# EasyEDA Pro project ProProject_stm32_motordrive_2024-05-07.epro

# Schematic Schematic
Create Date: 2024-04-02; Page Name: P1; Project Name: stm32-motordrive; Schematic Name: Schematic; Update Date: 2024-04-13; Company: 嘉立创EDA; Page Size: A4; Version: V1.0
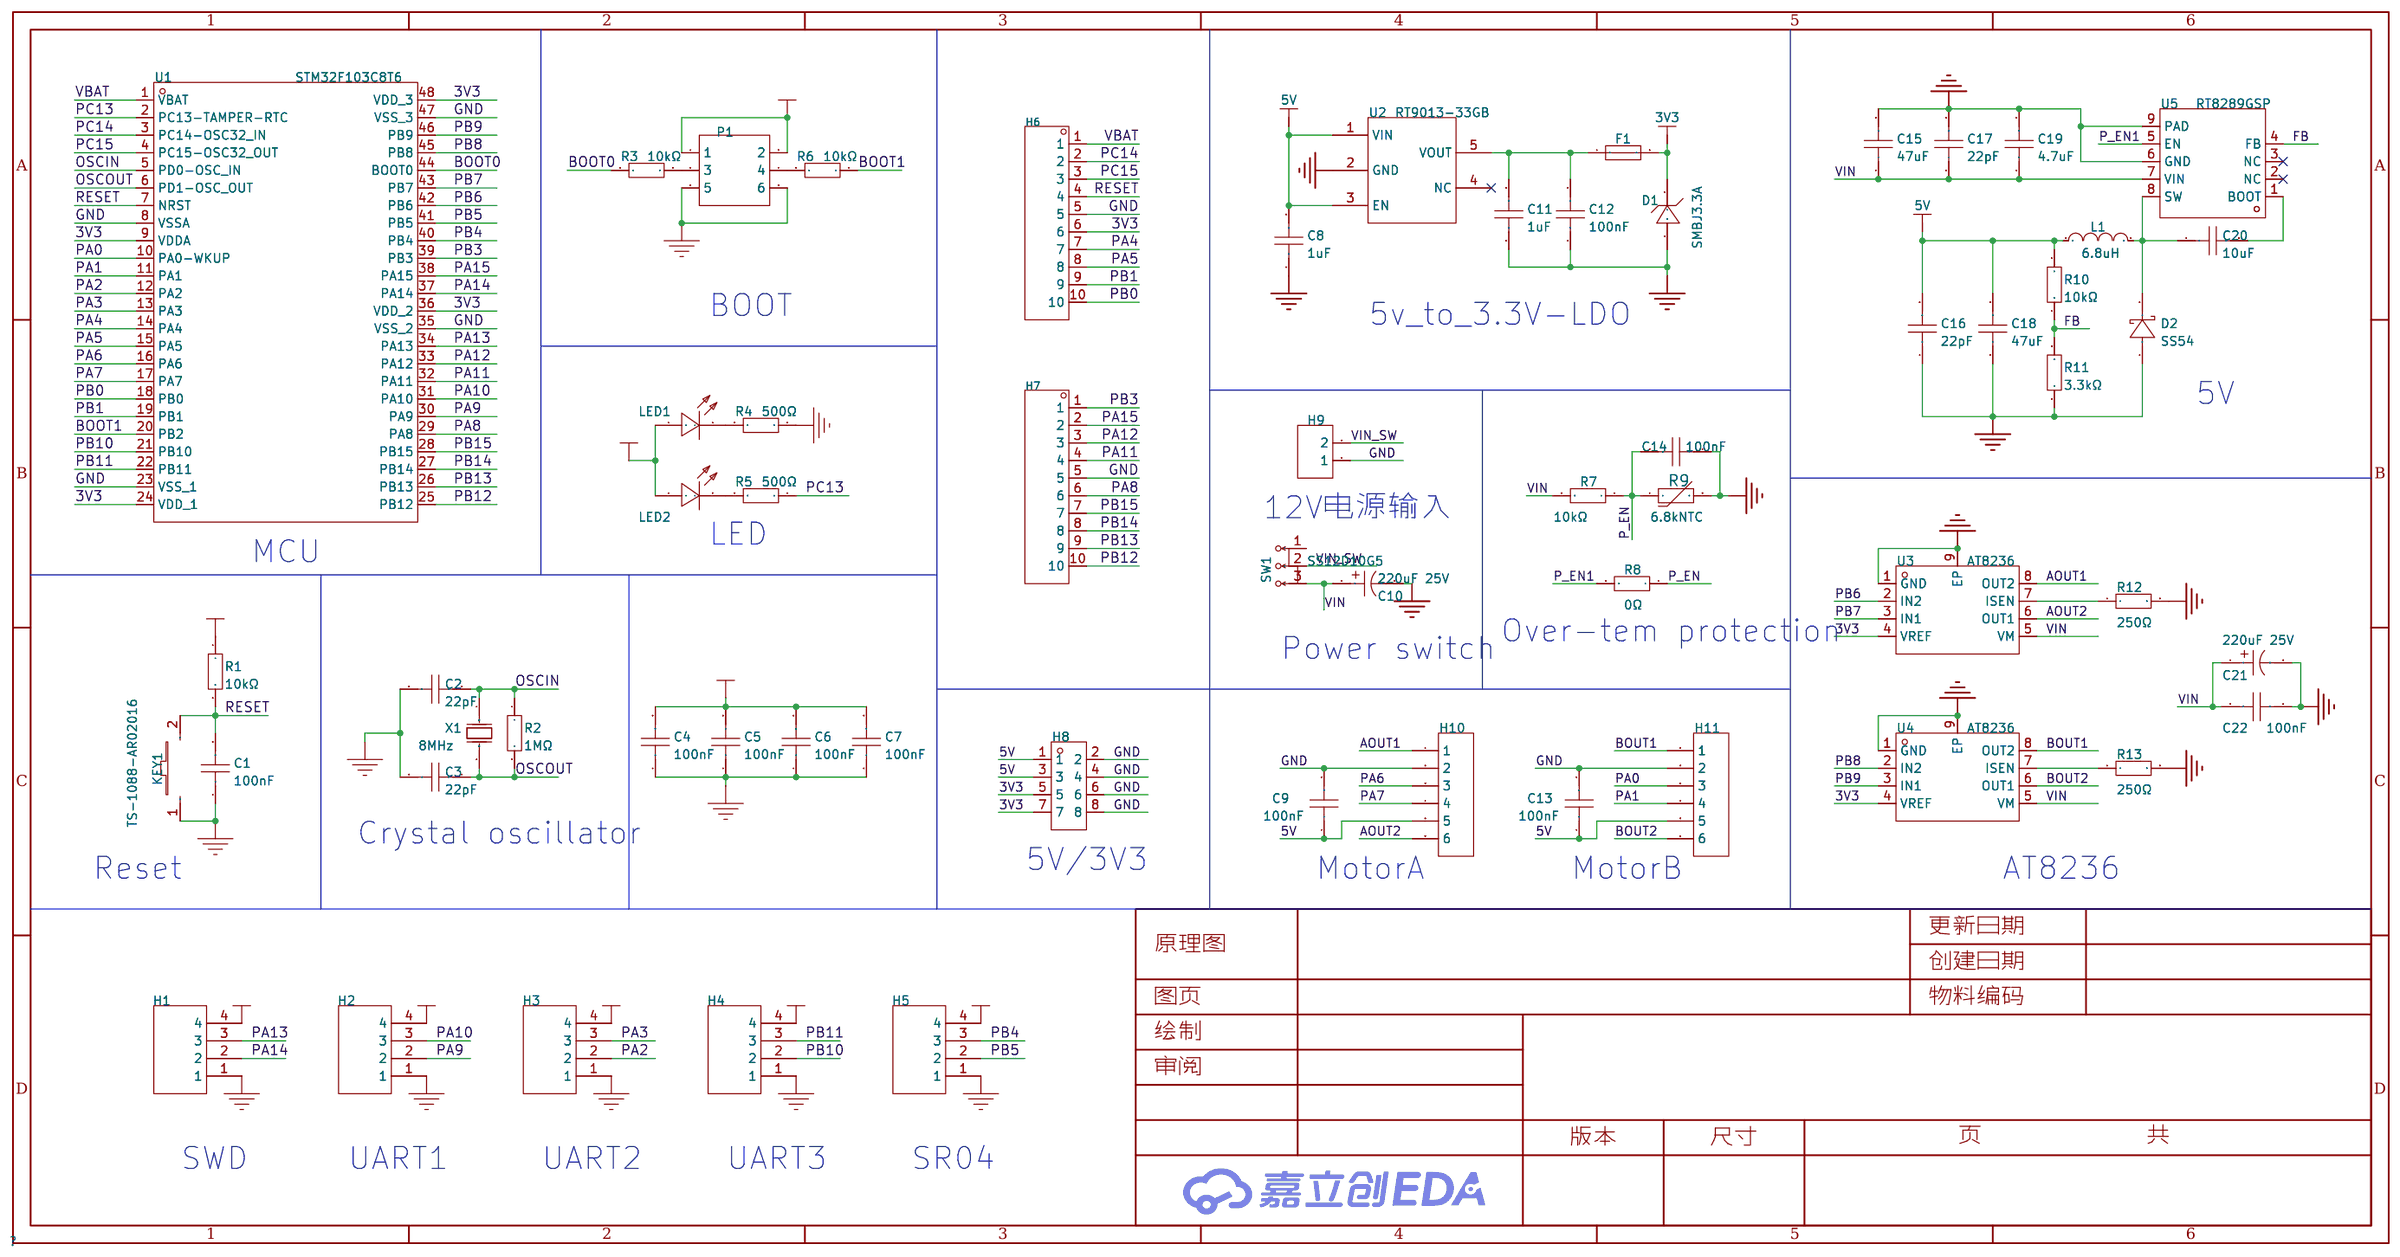
[diagram p0: schematic sheet]

## Parts
C1  100nF  [C0603]
C2  22pF  [C0603]
C3  22pF  [C0603]
C4  100nF  [C0603]
C5  100nF  [C0603]
C6  100nF  [C0603]
C7  100nF  [C0603]
C8  1uF  [C0603]
C9  100nF  [C0603]
C10  220uF 25V  [CAP-SMD_BD6.3-L6.6-W6.6-LS7.2-FD]
C11  1uF  [C0603]
C12  100nF  [C0603]
C13  100nF  [C0603]
C14  100nF  [C0603]
C15  47uF  [C0603]
C16  22pF  [C0603]
C17  22pF  [C0603]
C18  47uF  [C0603]
C19  4.7uF  [C0603]
C20  10uF  [C0603]
C21  220uF 25V  [CAP-SMD_BD6.3-L6.6-W6.6-LS7.2-FD]
C22  100nF  [C0603]
D1  SMBJ3.3A  [SMB_L4.6-W3.6-LS5.3-RD]
D2  SS54  [SMA_L4.3-W2.6-LS5.0-FD]
F1  BSMD0603-050-6V  [F0603]
H1  PZ254V-11-04P  [HDR-TH_4P-P2.54-V-M]
H2  PZ254V-11-04P  [HDR-TH_4P-P2.54-V-M]
H3  PZ254V-11-04P  [HDR-TH_4P-P2.54-V-M]
H4  PZ254V-11-04P  [HDR-TH_4P-P2.54-V-M]
H5  PZ254V-11-04P  [HDR-TH_4P-P2.54-V-M]
H6  2.54-1*10P针  [HDR-TH_10P-P2.54-V-M-1]
H7  2.54-1*10P针  [HDR-TH_10P-P2.54-V-M-1]
H8  PZ2.54-2*4  [HDR-TH_8P-P2.54-V-M-R2-C4-S2.54]
H9  XY301V-A-5.0-2P  [CONN-TH_XY301V-A-5.0-2P]
H10  -  [XH2.54-LI-6P弯针]
H11  -  [XH2.54-LI-6P弯针]
KEY1  TS-1088-AR02016  [SW-SMD_L3.9-W3.0-P4.45]
L1  6.8uH  [IND-SMD_L7.0-W6.6]
LED1  NCD0805R1  [LED0805-R-RD]
LED2  NCD0805R1  [LED0805-R-RD]
P1  2.54-2*3P针  [HDR-TH_6P-P2.54-V-M-R2-C3-S2.54-1]
R1  10kΩ  [R0603]
R2  1MΩ  [R0603]
R3  10kΩ  [R0603]
R4  500Ω  [R0603]
R5  500Ω  [R0603]
R6  10kΩ  [R0603]
R7  10kΩ  [R0603]
R8  0Ω  [R0603]
R9  6.8kNTC  [R0603]
R10  10kΩ  [R0603]
R11  3.3kΩ  [R0603]
R12  250Ω  [R0603]
R13  250Ω  [R0603]
SW1  SS12D10G5  [SW-TH_SHOU-HAN_SS12D10G4]
U1  STM32F103C8T6  [LQFP-48_L7.0-W7.0-P0.50-LS9.0-BL]
U2  RT9013-33GB  [SOT-23-5_L3.0-W1.7-P0.95-LS2.8-BL]
U3  AT8236  [ESOP-8_L4.9-W3.9-P1.27-LS6.0-BL-EP]
U4  AT8236  [ESOP-8_L4.9-W3.9-P1.27-LS6.0-BL-EP]
U5  RT8289GSP  [SOIC-8_L5.0-W4.0-P1.27-LS6.0-BL-EP2.0]
X1  8MHz  [CRYSTAL-SMD_L5.0-W3.2]

## Library data of the parts
C1 C4-C7 = CC0603KRX7R9BB104: 容值:100nF;精度:±10%;额定电压:50V;材质(温度系数):X7R;; LCSC Part Name: 100nF ±10% 50V; Supplier Part: C14663; Manufacturer: YAGEO(国巨); Supplier Footprint: 0603; JLCPCB Part Class: Basic Part; Datasheet: https://atta.szlcsc.com/upload/public/pdf/source/20180910/C282072_33301C7F631E79921B82A8DAC6BCC5B3.pdf; Supplier: LCSC; Tolerance: ±10%; Voltage Rated: 50V; Temperature Coefficient: X7R; Origin Footprint 1: 104
C2 C3 = CC0603JRNPO9BN220: 容值:22pF;精度:±5%;额定电压:50V;材质(温度系数):NP0;; LCSC Part Name: 22pF ±5% 50V; Supplier Part: C105620; Manufacturer: YAGEO(国巨); Supplier Footprint: 0603; JLCPCB Part Class: Extended Part; Datasheet: https://atta.szlcsc.com/upload/public/pdf/source/20170505/1493957838062.pdf; Supplier: LCSC; Tolerance: ±5%; Voltage Rated: 50V; Temperature Coefficient: NP0; Origin Footprint 1: 22P
C8 C11 = CL10A105KB8NNNC: 容值:1uF;精度:±10%;额定电压:50V;材质(温度系数):X5R;; LCSC Part Name: 1uF ±10% 50V; Supplier Part: C15849; Manufacturer: SAMSUNG(三星); Supplier Footprint: 0603; JLCPCB Part Class: Basic Part; Datasheet: https://atta.szlcsc.com/upload/public/pdf/source/20160218/1457707763339.pdf; Supplier: LCSC; Tolerance: ±10%; Voltage Rated: 50V; Temperature Coefficient: X5R
C9 C12-C14 C22 = CC0603KRX7R9BB104: 容值:100nF;精度:±10%;额定电压:50V;材质(温度系数):X7R;; LCSC Part Name: 100nF ±10% 50V; Supplier Part: C14663; Manufacturer: YAGEO(国巨); Supplier Footprint: 0603; JLCPCB Part Class: Basic Part; Datasheet: https://atta.szlcsc.com/upload/public/pdf/source/20180910/C282072_33301C7F631E79921B82A8DAC6BCC5B3.pdf; Supplier: LCSC; Tolerance: ±10%; Voltage Rated: 50V; Temperature Coefficient: X7R
C10 C21 = RST220UF25V019: 容值:220uF;精度:±20%;额定电压:25V;纹波电流:165mA@120Hz;等效串联电阻:-;; LCSC Part Name: 220uF ±20% 25V; Supplier Part: C4747974; Manufacturer: KNSCHA(科尼盛); Supplier Footprint: SMD,D6.3xL7.7mm; JLCPCB Part Class: Extended Part; Datasheet: https://atta.szlcsc.com/upload/public/pdf/source/20220722/2E7F51AC9BE193B364DA1207D7353D66.pdf; Supplier: LCSC; Tolerance: ±20%; Rated Voltage: 25V; Ripple Current: 165mA@120Hz; φD: 6.3mm; L: 7.7mm; Lifetime @ Temp: 2000hrs@105℃; Operating Temperature: -40℃~+105℃
C15 C18 = CL10A476MQ8QRNC: 容值:47uF;精度:±20%;额定电压:6.3V;材质(温度系数):X5R;; LCSC Part Name: 47uF ±20% 6.3V; Supplier Part: C730416; Manufacturer: SAMSUNG(三星); Supplier Footprint: 0603; JLCPCB Part Class: Extended Part; Datasheet: https://atta.szlcsc.com/upload/public/pdf/source/20160218/1457707763339.pdf; Supplier: LCSC; Tolerance: ±20%; Voltage Rated: 6.3V; Temperature Coefficient: X5R
C16 C17 = CC0603JRNPO9BN220: 容值:22pF;精度:±5%;额定电压:50V;材质(温度系数):NP0;; LCSC Part Name: 22pF ±5% 50V; Supplier Part: C105620; Manufacturer: YAGEO(国巨); Supplier Footprint: 0603; JLCPCB Part Class: Extended Part; Datasheet: https://atta.szlcsc.com/upload/public/pdf/source/20170505/1493957838062.pdf; Supplier: LCSC; Tolerance: ±5%; Voltage Rated: 50V; Temperature Coefficient: NP0
C19 = CL10A475KP8NNNC: 容值:4.7uF;精度:±10%;额定电压:10V;材质(温度系数):X5R;; LCSC Part Name: 4.7uF ±10% 10V; Supplier Part: C1705; Manufacturer: SAMSUNG(三星); Supplier Footprint: 0603; JLCPCB Part Class: Extended Part; Datasheet: https://atta.szlcsc.com/upload/public/pdf/source/20160218/1457707763339.pdf; Supplier: LCSC; Tolerance: ±10%; Voltage Rated: 10V; Temperature Coefficient: X5R
C20 = CL10A106KP8NNNC: 容值:10uF;精度:±10%;额定电压:10V;材质(温度系数):X5R;; LCSC Part Name: 10uF ±10% 10V; Supplier Part: C19702; Manufacturer: SAMSUNG(三星); Supplier Footprint: 0603; JLCPCB Part Class: Basic Part; Datasheet: https://atta.szlcsc.com/upload/public/pdf/source/20160218/1457707763339.pdf; Supplier: LCSC; Tolerance: ±10%; Voltage Rated: 10V; Temperature Coefficient: X5R
D1 = SMBJ3.3A_C362089: 反向截止电压(Vrwm):3.3V;最大钳位电压:7.3V;峰值脉冲功率(Ppp)@10/1000us:600W;击穿电压:4.1V;; LCSC Part Name: 单向TVS 3.3V截止 600W峰值脉冲功率; Supplier Part: C362089; Manufacturer: JKSEMI(金开盛); Supplier Footprint: SMB(DO-214AA); JLCPCB Part Class: 扩展库; Datasheet: https://atta.szlcsc.com/upload/public/pdf/source/20200731/C362089_3B984BF84356FE4A5051ADB3F5B1E766.pdf; Supplier: LCSC; Reverse Stand-Off Voltage (Vrwm): 3.3V; Maximum Clamping Voltage: 7.3V; Peak Pulse Power Dissipation (Ppp)@10/1000us: 600W; Breakdown Voltage: 4.1V; Type: TVS
D2 = SS54_C7420369: 二极管配置:独立式;正向压降(Vf):550mV@5.0A;直流反向耐压(Vr):40V;平均整流电流(Io):5A;; LCSC Part Name: 电压:40V 电流:5A; Supplier Part: C7420369; Manufacturer: 宏迦橙; Supplier Footprint: SMA(DO-214AC); JLCPCB Part Class: 扩展库; Datasheet: https://atta.szlcsc.com/upload/public/pdf/source/20230828/254C3882F8647358AD9F60DD73611B5E.pdf; Supplier: LCSC; Diode Configuration: 独立式; Forward Voltage (Vf@If): 550mV@5.0A; Reverse Voltage (Vr): 40V; Average Rectified Current (Io): 5A; Reverse Leakage Current (Ir): 50uA@40V; Peak forward surge current: 120A
F1 = BSMD0603-050-6V: 最大电压:6V;最大电流:40A;保持电流:500mA;跳闸电流:1A;; LCSC Part Name: 6V 500mA 0603自恢复; Supplier Part: C883095; Manufacturer: BHFUSE(佰宏); Supplier Footprint: 0603; JLCPCB Part Class: Extended Part; Datasheet: https://atta.szlcsc.com/upload/public/pdf/source/20230512/E478DE3555A0061DA0124A9F45802B86.pdf; Supplier: LCSC; Operating Voltage (Max): 6V; Current Rating (Max): 40A; Hold Current: 500mA; Trip Current: 1A; Power Dissipation: 500mW; Resistance - Initial (Ri) (Min): 100mΩ; Resistance - Post Trip (R1) (Max): 800mΩ; Maximum Time to Trip: 100ms; Operating Temperature: -40℃~+85℃
H1-H5 = PZ254V-11-04P: 插针结构:1x4P;间距:2.54mm;行距:-;圆针/方针:方针;安装类型:直插;排数:单排;总PIN位数:4P;额定电流:3A;额定电压:250V;配合针长度:6mm;塑高:2.5mm;端接针长度:3mm;触头材质:-;工作温度范围:-40℃~+105℃;颜色:黑色;; LCSC Part Name: 间距:2.54mm 1x4P 直插 方针; Supplier Part: C2691448; Manufacturer: XFCN(兴飞); Supplier Footprint: 插件,P=2.54mm; JLCPCB Part Class: Extended Part; Datasheet: https://atta.szlcsc.com/upload/public/pdf/source/20200309/C492403_F9F19131791D08044AD4F84F8E751A34.pdf; Supplier: LCSC; Pin Structure: 1x4P; Pitch: 2.54mm; Circluar Pins/Square Pins: 方针; Mounting Type: 直插; Number of Rows: 单排; Number of Pins: 4P; Current Rating (Max): 3A; Voltage Rating (Max): 250V; Length of Mating Pin: 6mm; Insulation Height: 2.5mm; Length of End Connection Pin: 3mm; Operating Temperature Range: -40℃~+105℃; Color: 黑色; Origin Footprint 1: 220S-1*4P H=8.5MM Ytype Gold-plated; Origin Footprint 2: DIP-1X4P2.54
H6 H7 = 2.54-1*10P针: 插针结构:1x10P;间距:2.54mm;行距:-;圆针/方针:方针;安装类型:直插;排数:单排;总PIN位数:10P;额定电流:3A;额定电压:-;配合针长度:-;塑高:-;端接针长度:-;触头材质:-;触头镀层:-;工作温度范围:-40℃~+105℃;颜色:黑色;; LCSC Part Name: 间距:2.54mm 1x10P 直插 方针; Supplier Part: C57369; Manufacturer: BOOMELE(博穆精密); Supplier Footprint: 插件,P=2.54mm; JLCPCB Part Class: 扩展库; Datasheet: https://atta.szlcsc.com/upload/public/pdf/source/20151109/1457707572883.pdf; Supplier: LCSC; Pin Structure: 1x10P; Pitch: 2.54mm; Circluar Pins/Square Pins: 方针; Mounting Type: 直插; Number of Rows: 单排; Number of Pins: 10P; Current Rating (Max): 3A; Operating Temperature Range: -40℃~+105℃; Color: 黑色
H8 = PZ2.54-2*4: 插针结构:2x4P;间距:2.54mm;排数:双排;总PIN位数:8P;; Supplier Part: C5156676; Manufacturer: ZHOURI(洲日); Supplier Footprint: 插件,P=2.54mm; JLCPCB Part Class: 扩展库; Datasheet: https://atta.szlcsc.com/upload/public/pdf/source/20220923/0E7A4A94740FFD503E2D73F36F92C1EA.pdf; Supplier: LCSC; Pin Structure: 2x4P; Pitch: 2.54mm; Number of Rows: 双排; Number of Pins: 8P
H9 = XY301V-A-5.0-2P: 结构:1x2P;间距:5mm;颜色:蓝色;安装方式:直插;额定电流:15A;额定电压:300V;排数:1;线规 - AWG:14~22;线规 - 平方毫米:1.5;每排PIN数:2;工作温度范围:-;; LCSC Part Name: 5mm 1x2P 排数:1 每排P数:2 直插; Supplier Part: C557651; Manufacturer: XINLAIYA(新莱亚); Supplier Footprint: 插件,P=5mm; JLCPCB Part Class: Extended Part; Datasheet: https://atta.szlcsc.com/upload/public/pdf/source/20200527/C557652_0563DB88D69D1781C63AEA43A3E9DCA1.pdf; Supplier: LCSC; Structure: 1x2P; Pitch: 5mm; Color: 蓝色; Mounting Style: 直插; Current Rating (Max): 15A; Voltage Rating (Max): 300V; Number of Pins: 2P; Number of Rows: 1; Wire Gauge - AWG: 14~22; Wire Gauge - mm2: 1.5; Number of PINs Per Row: 2
H10 H11 = XH2.54-LI-6P弯针
KEY1 = TS-1088-AR02016: 电路结构:单刀单掷;按钮形状:圆形按钮;作用力:160gf;安装方式:立贴;开关长度:4mm;开关宽度:3mm;开关高度:2mm;带支架:不带;触点电流:50mA;额定电压(DC):12V;绝缘电阻:100MΩ;机械寿命:10万次;; LCSC Part Name: 4*3*2mm 立贴 轻触开关; Supplier Part: C720477; Manufacturer: XUNPU(讯普); Supplier Footprint: SMD; JLCPCB Part Class: Extended Part; Datasheet: https://atta.szlcsc.com/upload/public/pdf/source/20200810/C720475_60D09DD6C54279ADDB2DC25100F1CC11.pdf; Supplier: LCSC; Circuit: 单刀单掷; Actuator Style: 圆形按钮; Operating Force: 160gf; Mounting Style: 立贴; Switch Length: 4mm; Switch Width: 3mm; Switch Height: 2mm; Strike Gundam: 不带; Contact Current: 50mA; Voltage Rating (DC): 12V; Insulation Resistance: 100MΩ; Actuator/Cap Color: 黑色; Pin Style: SMD接片; Mechanical Life: 10万次; Operating Temperature: -30℃~+80℃; Origin Footprint 1: Switch3x4x2; Origin Footprint 2: KEY-3.0*4.0
L1 = FXL0630-6R8-M: 电感值:6.8uH;精度:±20%;额定电流:5A;饱和电流(Isat):6A;类型:一体成型电感;; LCSC Part Name: 6.8uH ±20% 6A; Supplier Part: C167221; Manufacturer: cjiang(长江微电); Supplier Footprint: SMD,6.6x7mm; JLCPCB Part Class: Extended Part; Datasheet: https://atta.szlcsc.com/upload/public/pdf/source/20230516/3A080F5AF8C87BB81C3BA86E5F60E51A.pdf; Supplier: LCSC; Tolerance: ±20%; Rated Current: 5A; Saturation Current (Isat): 6A; DC Resistance (DCR): 48mΩ; Type: 一体成型电感
LED1 LED2 = NCD0805R1: 灯头类型:-;发光颜色:红色;正向电压(VF):1.6V~2.6V;功率:65mW;正向电流:20mA;主波长:615nm~630nm;二极管配置:独立二极管;透镜颜色:无色透明透镜;色温:-;发光强度:67mcd~195mcd;发光角度:130°;载带方式:-;工作温度:-30℃~+85℃;; Supplier Part: C84256; Manufacturer: 国星光电; Supplier Footprint: 0805; JLCPCB Part Class: Basic Part; Datasheet: https://atta.szlcsc.com/upload/public/pdf/source/20200820/C84256_F0A75A43B3EAD75808600A0514C76B99.pdf; Supplier: LCSC; Emitted Color: 红色; Forward Voltage (VF): 1.6V~2.6V; Power Dissipation: 65mW; Forward Current: 20mA; Dominant Wavelength: 615nm~630nm; Diode Configuration: 独立二极管; Lens Color: 无色透明透镜; Luminous Intensity: 67mcd~195mcd; Viewing Angle: 130°; Operating Temperature: -30℃~+85℃; Origin Footprint 1: 204-10SURD/S530-A3; Origin Footprint 2: LED0805-RD
P1 = 2.54-2*3P针: 插针结构:-;间距:2.54mm;行距:-;圆针/方针:-;安装类型:直插;排数:双排;总PIN位数:6P;额定电流:-;额定电压:-;配合针长度:-;塑高:-;触头材质:-;触头镀层:-;颜色:黑色;; LCSC Part Name: 间距:2.54mm 直插; Supplier Part: C65114; Manufacturer: BOOMELE(博穆精密); Supplier Footprint: 插件,P=2.54mm; JLCPCB Part Class: Extended Part; Supplier: LCSC; Pitch: 2.54mm; Mounting Type: 直插; Number of Rows: 双排; Number of Pins: 6P; Color: 黑色; Origin Footprint 1: HDR-IDC-2.54-2X3P; image: //image.lceda.cn/szlcsc/C11214.jpg; Origin Footprint 2: HEADER_PRG_2X3
R1 R3 R6 = 0603WAF1002T5E: 电阻类型:厚膜电阻;阻值:10kΩ;精度:±1%;功率:100mW;最大工作电压:75V;温度系数:±100ppm/℃;; LCSC Part Name: 厚膜电阻 10kΩ ±1% 100mW; Supplier Part: C25804; Manufacturer: UNI-ROYAL(厚声); Supplier Footprint: 0603; JLCPCB Part Class: Basic Part; Datasheet: https://atta.szlcsc.com/upload/public/pdf/source/20200306/C422600_1E6D84923E4A46A82E41ADD87F860B5C.pdf; Supplier: LCSC; Type: 厚膜电阻; Tolerance: ±1%; Power(Watts): 100mW; Overload Voltage (Max): 75V; Temperature Coefficient: ±100ppm/℃; Operating Temperature Range: -55℃~+155℃
R2 = 0603WAF1004T5E: 电阻类型:厚膜电阻;阻值:1MΩ;精度:±1%;功率:100mW;最大工作电压:75V;温度系数:±100ppm/℃;; LCSC Part Name: 1MΩ ±1% 100mW 厚膜电阻; Supplier Part: C22935; Manufacturer: UNI-ROYAL(厚声); Supplier Footprint: 0603; JLCPCB Part Class: Basic Part; Datasheet: https://atta.szlcsc.com/upload/public/pdf/source/20200306/C422600_1E6D84923E4A46A82E41ADD87F860B5C.pdf; Supplier: LCSC; Type: 厚膜电阻; Tolerance: ±1%; Power(Watts): 100mW; Overload Voltage (Max): 75V; Temperature Coefficient: ±100ppm/℃; Operating Temperature Range: -55℃~+155℃
R4 R5 = RT0603BRC07500RL: 电阻类型:薄膜电阻;阻值:500Ω;精度:±0.1%;功率:100mW;温度系数:±15ppm/℃;; LCSC Part Name: 薄膜电阻 500Ω ±0.1% 100mW; Supplier Part: C860931; Manufacturer: YAGEO(国巨); Supplier Footprint: 0603; JLCPCB Part Class: Extended Part; Datasheet: https://atta.szlcsc.com/upload/public/pdf/source/20200306/C422600_1E6D84923E4A46A82E41ADD87F860B5C.pdf; Supplier: LCSC; Type: 薄膜电阻; Tolerance: ±0.1%; Power(Watts): 100mW; Temperature Coefficient: ±15ppm/℃; Operating Temperature Range: -55℃~+155℃; Overload Voltage (Max): 75V
R7 R10 = RT0603BRD0710KL: 电阻类型:薄膜电阻;阻值:10kΩ;精度:±0.1%;功率:100mW;最大工作电压:75V;温度系数:±25ppm/℃;; LCSC Part Name: 薄膜电阻 10kΩ ±0.1% 100mW; Supplier Part: C95204; Manufacturer: YAGEO(国巨); Supplier Footprint: 0603; JLCPCB Part Class: Extended Part; Datasheet: https://atta.szlcsc.com/upload/public/pdf/source/20170217/1487301593756.pdf; Supplier: LCSC; Type: 薄膜电阻; Tolerance: ±0.1%; Power(Watts): 100mW; Overload Voltage (Max): 75V; Temperature Coefficient: ±25ppm/℃; Operating Temperature Range: -55℃~+155℃
R8 = 0603WAF0000T5E: 电阻类型:厚膜电阻;阻值:0Ω;精度:±1%;功率:100mW;最大工作电压:75V;; LCSC Part Name: 0Ω ±1% 100mW 厚膜电阻; Supplier Part: C21189; Manufacturer: UNI-ROYAL(厚声); Supplier Footprint: 0603; JLCPCB Part Class: Basic Part; Datasheet: https://atta.szlcsc.com/upload/public/pdf/source/20200306/C422600_1E6D84923E4A46A82E41ADD87F860B5C.pdf; Supplier: LCSC; Type: 厚膜电阻; Tolerance: ±1%; Power(Watts): 100mW; Overload Voltage (Max): 75V; Operating Temperature Range: -55℃~+155℃
R9 = NCP18XW682J03RB: 阻值(25℃):6.8kΩ;B值(25℃/50℃):3950K;电阻精度:±5%;功率:100mW;B值精度:±3%;最大稳态电流(25℃):380uA;; LCSC Part Name: 6.8kΩ 电阻精度:±5% 3950K; Supplier Part: C86145; Manufacturer: muRata(村田); Supplier Footprint: 0603; JLCPCB Part Class: Extended Part; Datasheet: https://atta.szlcsc.com/upload/public/pdf/source/20191017/C437581_F6360BF8E6A38281D0EED84DF6C92458.pdf; Supplier: LCSC; Resistance @ 25℃: 6.8kΩ; B Constant (25℃/50℃): 3950K; Resistance Tolerance: ±5%; B Constant (25℃/85℃): 3987K; B Constant (25℃/100℃): 3998K; Power: 100mW; B Constant Tolerance: ±3%; Steady State Current (Max): 380uA; Operating Temperature: -40℃~+125℃
R11 = 0603WAF3301T5E: 电阻类型:厚膜电阻;阻值:3.3kΩ;精度:±1%;功率:100mW;最大工作电压:75V;温度系数:±100ppm/℃;; LCSC Part Name: 3.3kΩ ±1% 100mW 厚膜电阻; Supplier Part: C22978; Manufacturer: UNI-ROYAL(厚声); Supplier Footprint: 0603; JLCPCB Part Class: Basic Part; Datasheet: https://atta.szlcsc.com/upload/public/pdf/source/20200306/C422600_1E6D84923E4A46A82E41ADD87F860B5C.pdf; Supplier: LCSC; Type: 厚膜电阻; Tolerance: ±1%; Power(Watts): 100mW; Overload Voltage (Max): 75V; Temperature Coefficient: ±100ppm/℃; Operating Temperature Range: -55℃~+155℃
R12 R13 = RT0603BRE07250RL: 电阻类型:薄膜电阻;阻值:250Ω;精度:±0.1%;功率:100mW;温度系数:±50ppm/℃;; LCSC Part Name: 薄膜电阻 250Ω ±0.1% 100mW; Supplier Part: C861779; Manufacturer: YAGEO(国巨); Supplier Footprint: 0603; JLCPCB Part Class: Extended Part; Datasheet: https://atta.szlcsc.com/upload/public/pdf/source/20200610/C326738_5639A9F1B6EB6E4AE2197577D3456E7F.pdf; Supplier: LCSC; Type: 薄膜电阻; Tolerance: ±0.1%; Power(Watts): 100mW; Temperature Coefficient: ±50ppm/℃; Operating Temperature Range: -55℃~+155℃
SW1 = SS12D10G5: 电路结构:单刀双掷;安装方式:直插;额定电流(DC):2A;额定电压(DC):125V;机械寿命:3千次;; LCSC Part Name: 两档立式插件 3脚拨动开关 柄长5.0mm; Supplier Part: C7431054; Manufacturer: SHOU HAN(首韩); Supplier Footprint: 插件; JLCPCB Part Class: Extended Part; Datasheet: https://atta.szlcsc.com/upload/public/pdf/source/20231130/7A3DB6A149BF0A1DCFFE64FFC07FE434.pdf; Supplier: LCSC; Circuit: 单刀双掷; Switch Length: 12.7mm; Switch Width: 6.7mm; Mounting Style: 直插; Current Rating (DC): 2A; Voltage Rating (DC): 125V; Mechanical Life: 3千次; Operating Temperature: -25℃~+70℃
U1 = STM32F103C8T6: CPU内核:CM3;程序存储容量:64KB;RAM总容量:20KB;GPIO端口数量:37;工作电压范围:2V~3.6V;CPU最大主频:72MHz;程序存储器类型:FLASH;; LCSC Part Name: STM32F103C8T6 MSL=3; Supplier Part: C8734; Manufacturer: ST(意法半导体); Supplier Footprint: LQFP-48(7x7); JLCPCB Part Class: Extended Part; Datasheet: https://atta.szlcsc.com/upload/public/pdf/source/20220812/8363ACEC51AD55ECEB84799464F7CB85.pdf; Supplier: LCSC; CPU Core: CM3; Program Storage Size: 64KB; RAM Size: 20KB; GPIO Ports Number: 37; Operating Voltage Range: 2V~3.6V; CPU Maximum Speed: 72MHz; Program Memory Type: FLASH; Operating Temperature Range: -40℃~+85℃; ADC (Bit): 12bit; Universal Serial Bus: 有; Peripheral/Function: 看门狗；DMA；看门狗；片载温度传感器; Watchdog: 有; Infrared Data Association: 有; Low-Voltage Detect: 有; Direct Memory Access: 有; Internal Oscillator: 有; image: //image.lceda.cn/szlcsc/C8734.jpg
U2 = RT9013-33GB: 输出类型:固定;最大输入电压:5.5V;输出电压:3.3V;最大输出电流:500mA;电源纹波抑制比(PSRR):50dB@(10kHz);输出极性:正极;; LCSC Part Name: 输入5.5V 输出3.3V 500mA; Supplier Part: C47773; Manufacturer: RICHTEK(立锜); Supplier Footprint: SOT-23-5; JLCPCB Part Class: 扩展库; Datasheet: https://atta.szlcsc.com/upload/public/pdf/source/20150504/1457707282459.pdf; Supplier: LCSC; Output Type: 固定; Maximum Input Voltage: 5.5V; Output Voltage: 3.3V; MAX Output Current: 500mA; Power Supply Rejection Ratio (PSRR): 50dB@(10kHz); Dropout Voltage: 400mV@(500mA); standby current: 50uA; Operating Temperature: -40℃~+85℃; Output Polarity: 正极; Number of Outputs: 1
U3 U4 = AT8236: Supplier Part: C2827823; Manufacturer: 杭州中科微; Supplier Footprint: ESOP-8; JLCPCB Part Class: 扩展库; Datasheet: https://atta.szlcsc.com/upload/public/pdf/source/20210923/1552D95CBAF8BE780D06AE79E7783380.pdf; Supplier: LCSC
U5 = RT8289GSP: 功能类型:降压型;输出类型:可调;输入电压:5.5V~32V;输出电压:1.222V~26V;输出电流(最大值):5A;; Supplier Part: C39202; Manufacturer: RICHTEK(立锜); Supplier Footprint: SOIC-8-EP; JLCPCB Part Class: 扩展库; Datasheet: https://atta.szlcsc.com/upload/public/pdf/source/20141219/1457707253176.pdf; Supplier: LCSC; Function: 降压型; Output Type: 可调; Input Voltage: 5.5V~32V; Output Voltage: 1.222V~26V; Output Current (Max): 5A; Switching Frequency: 500kHz; Operating Temperature: -40℃~+85℃@(TA); Synchronous Rectification: 否; Number of Outputs: 1; Topology: 降压式; Switch tube (built-in/external): 内置
X1 = X50328MSB2GI: 晶振类型:贴片晶振;频率:8MHz;常温频差:±10ppm;外接负载电容:20pF;频率稳定度(全温):±20ppm;; LCSC Part Name: 8MHz ±10ppm 20pF YSX530GA; Supplier Part: C115962; Manufacturer: YXC(扬兴晶振); Supplier Footprint: SMD5032; JLCPCB Part Class: Basic Part; Datasheet: https://atta.szlcsc.com/upload/public/pdf/source/20240329/44922B0AF7B60E58E9B66993B6077277.pdf; Supplier: LCSC; Crystal Type: 贴片晶振; Normal temperature Frequency Tolerance: ±10ppm; External load capacitor: 20pF; Frequency Stability(Full temperature range): ±20ppm; Operating Temperature: -40℃~+85℃; Origin Footprint 2: HC-49-SMD_L7.0-W3.0

## Nets
3V3: C4.2 C5.2 C6.2 C7.2 D1.1 F1.2 H6.6 H8.5 H8.7 LED1.1(A) LED2.1(A) P1.1 P1.2 R1.1 U1.9(VDDA) U1.24(VDD_1) U1.36(VDD_2) U1.48(VDD_3) U3.4(VREF) U4.4(VREF)
5V: C8.2 C9.1 C13.1 C16.2 C18.2 H1.4 H2.4 H3.4 H4.4 H5.4 H8.1 H8.3 H10.5 H11.5 L1.1 R10.2 U2.1(VIN) U2.3(EN)
GND: C1.1 C2.2 C3.2 C4.1 C5.1 C6.1 C7.1 C8.1 C9.2 C10.2 C11.1 C12.1 C13.2 C14.1 C15.2 C16.1 C17.2 C18.1 C19.2 C21.2 C22.1 D1.2 D2.1(A) H1.1 H2.1 H3.1 H4.1 H5.1 H6.5 H7.5 H8.2 H8.4 H8.6 H8.8 H9.1 H10.2 H11.2 KEY1.1 P1.5 P1.6 R4.1 R9.2 R11.1 R12.2 R13.2 U1.8(VSSA) U1.23(VSS_1) U1.35(VSS_2) U1.47(VSS_3) U2.2(GND) U3.1(GND) U3.9(EP) U4.1(GND) U4.9(EP) U5.6(GND) U5.9(PAD)
VBAT: H6.1 U1.1(VBAT)
VIN: C10.1 C15.1 C17.1 C19.1 C21.1 C22.2 R7.2 SW1.3 U3.5(VM) U4.5(VM) U5.7(VIN)
VIN_SW: H9.2 SW1.2
AOUT1: H10.1 U3.8(OUT2)
AOUT2: H10.6 U3.6(OUT1)
BOOT0: R3.2 U1.44(BOOT0)
BOOT1: R6.1 U1.20(PB2)
BOUT1: H11.1 U4.8(OUT2)
BOUT2: H11.6 U4.6(OUT1)
FB: R10.1 R11.2 U5.4(FB)
OSCIN: C2.1 R2.1 U1.5(PD0-OSC_IN) X1.1(OSC1)
OSCOUT: C3.1 R2.2 U1.6(PD1-OSC_OUT) X1.2(OSC2)
P_EN: C14.2 R7.1 R8.1 R9.1
P_EN1: R8.2 U5.5(EN)
PA0: H11.3 U1.10(PA0-WKUP)
PA1: H11.4 U1.11(PA1)
PA2: H3.2 U1.12(PA2)
PA3: H3.3 U1.13(PA3)
PA4: H6.7 U1.14(PA4)
PA5: H6.8 U1.15(PA5)
PA6: H10.3 U1.16(PA6)
PA7: H10.4 U1.17(PA7)
PA8: H7.6 U1.29(PA8)
PA9: H2.2 U1.30(PA9)
PA10: H2.3 U1.31(PA10)
PA11: H7.4 U1.32(PA11)
PA12: H7.3 U1.33(PA12)
PA13: H1.3 U1.34(PA13)
PA14: H1.2 U1.37(PA14)
PA15: H7.2 U1.38(PA15)
PB0: H6.10 U1.18(PB0)
PB1: H6.9 U1.19(PB1)
PB3: H7.1 U1.39(PB3)
PB4: H5.3 U1.40(PB4)
PB5: H5.2 U1.41(PB5)
PB6: U1.42(PB6) U3.2(IN2)
PB7: U1.43(PB7) U3.3(IN1)
PB8: U1.45(PB8) U4.2(IN2)
PB9: U1.46(PB9) U4.3(IN1)
PB10: H4.2 U1.21(PB10)
PB11: H4.3 U1.22(PB11)
PB12: H7.10 U1.25(PB12)
PB13: H7.9 U1.26(PB13)
PB14: H7.8 U1.27(PB14)
PB15: H7.7 U1.28(PB15)
PC13: R5.1 U1.2(PC13-TAMPER-RTC)
PC14: H6.2 U1.3(PC14-OSC32_IN)
PC15: H6.3 U1.4(PC15-OSC32_OUT)
RESET: C1.2 H6.4 KEY1.2 R1.2 U1.7(NRST)
$1N6534: C20.2 U5.1(BOOT)
$1N6587: C20.1 D2.2(K) L1.2 U5.8(SW)
$1N6590: R12.1 U3.7(ISEN)
$1N26418: R13.1 U4.7(ISEN)
$1N71314: C11.2 C12.2 F1.1 U2.5(VOUT)
$1N86703: LED1.2(K) R4.2
$1N86706: LED2.2(K) R5.2
$1N86975: P1.4 R6.2
$1N86977: P1.3 R3.1

Not connected (* = marked no-connect by the designer): SW1 1; U2 4(NC)*; U5 2(NC)* 3(NC)*

## Notes on the sheet
- BOOT
- 5v_to_3.3V-LDO
- 5V
- 12V电源输入
- LED
- MCU
- Over-tem protection
- Power switch
- Crystal oscillator
- 5V/3V3
- Reset
- MotorA
- MotorB
- AT8236
- SWD
- UART1
- UART2
- UART3
- SR04

# Board PCB
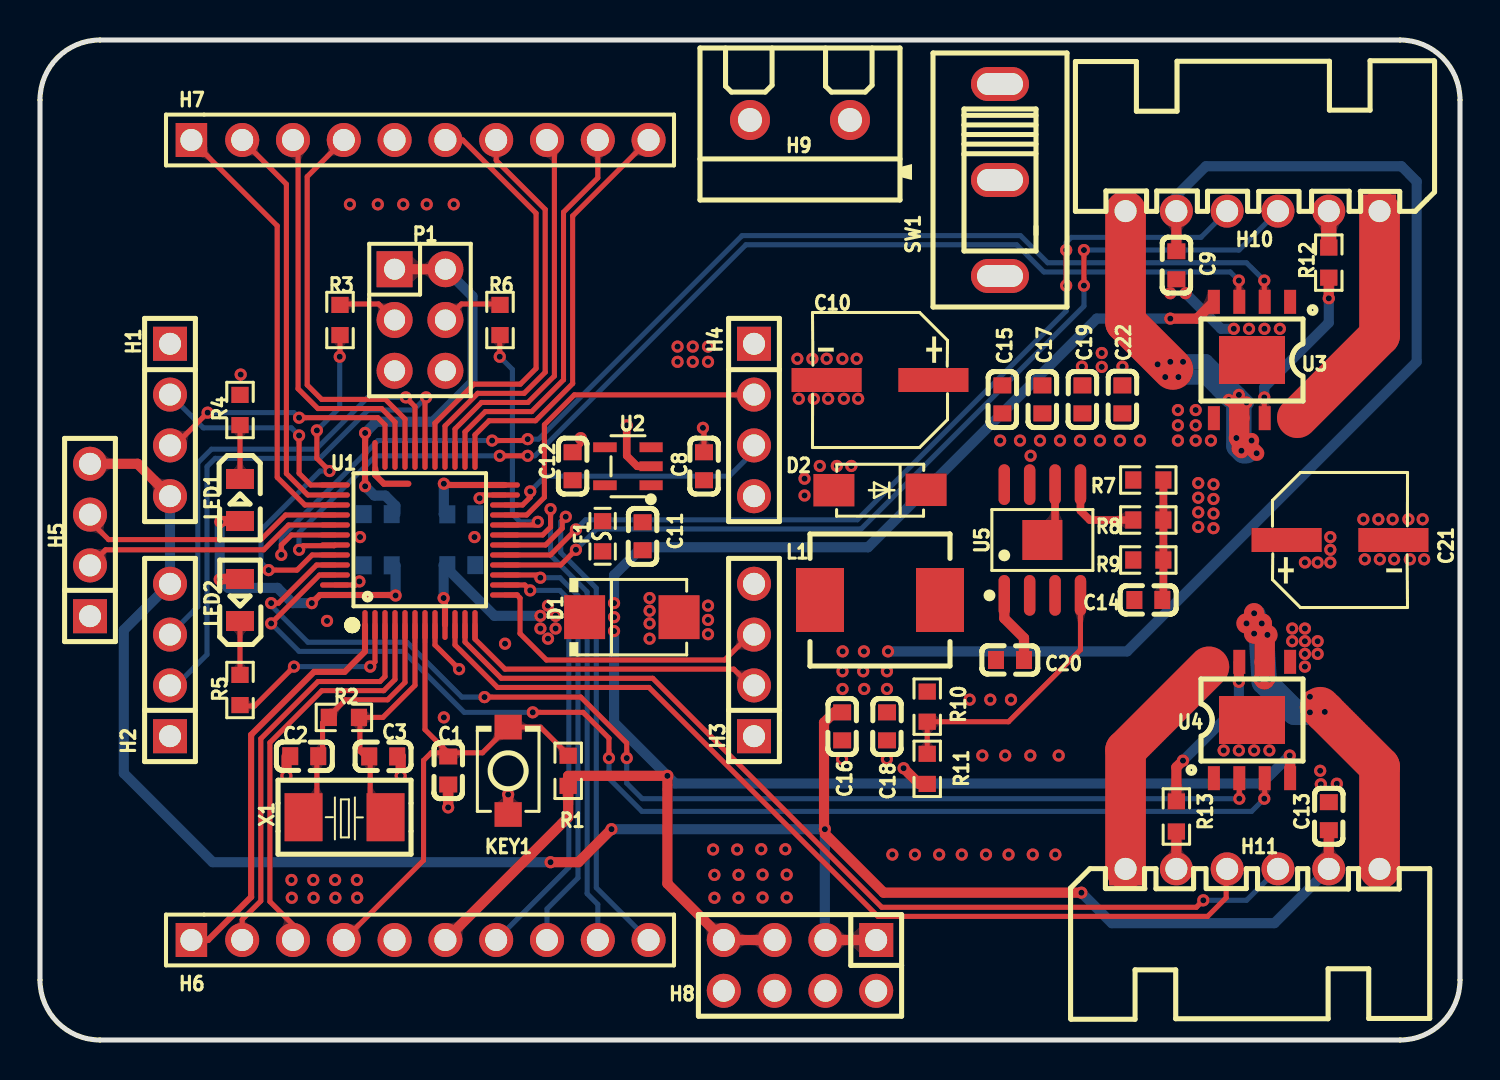
[diagram p1: board, top side]
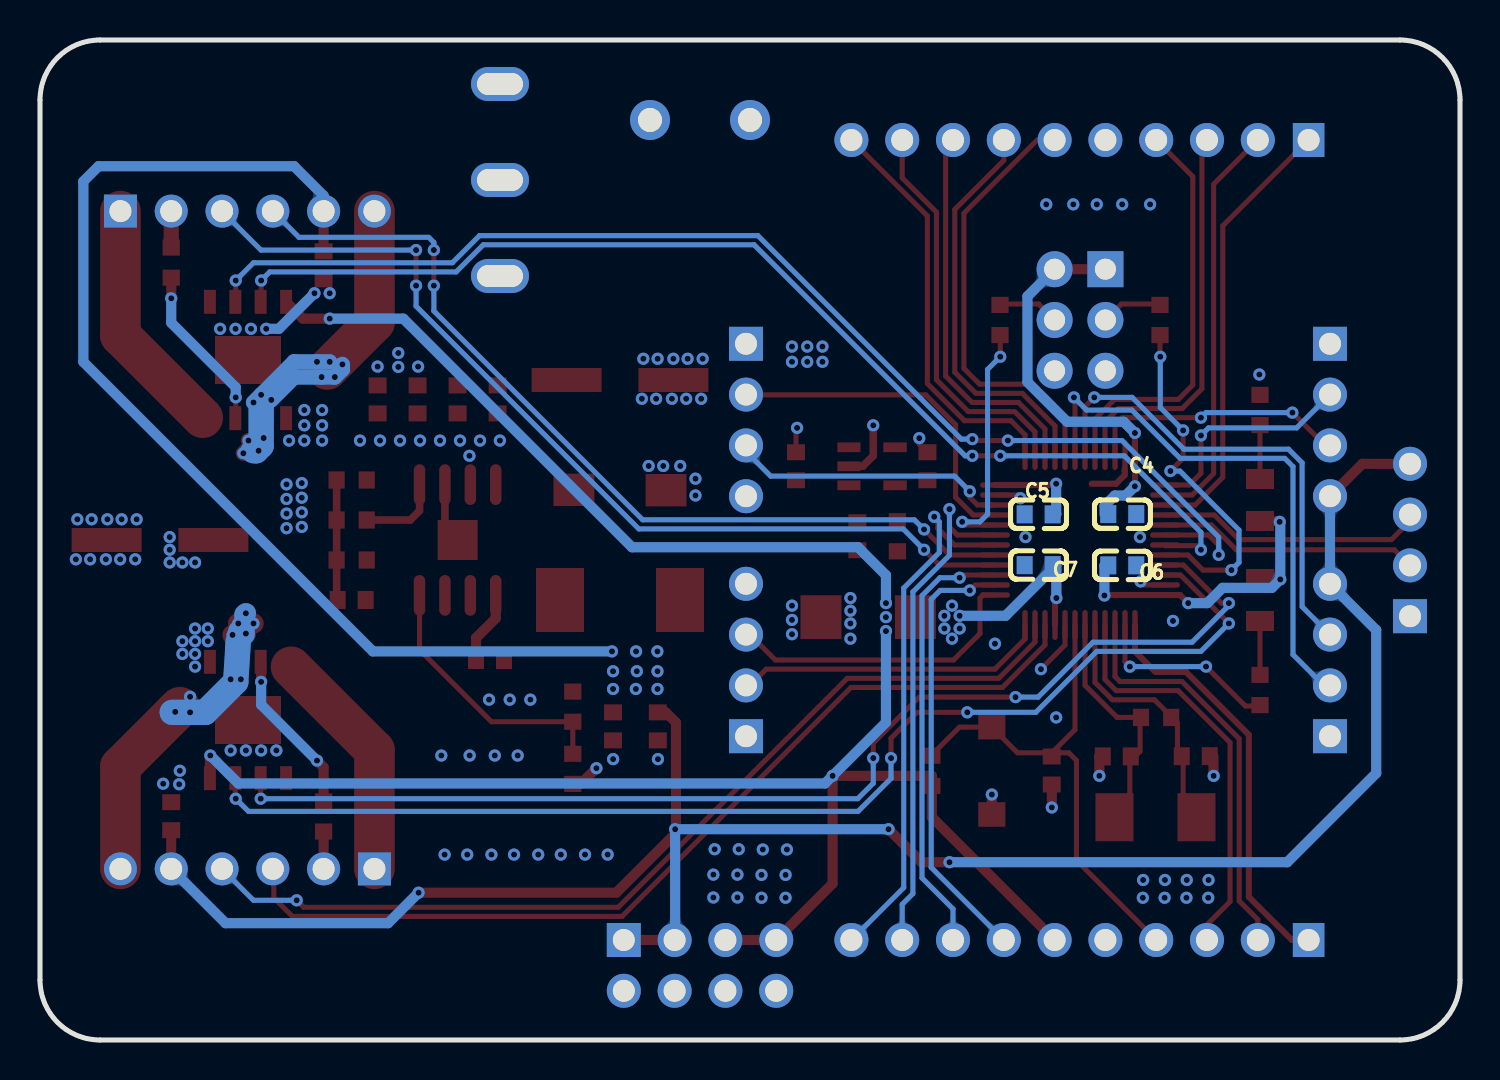
[diagram p2: board, bottom side, seen from below]

Outline 71 x 50 mm; copper layers: Top Layer, Bottom Layer. Coordinates in mm from the lower left corner of the outline.
Outline path: 0,47 0,3 arc(0.88,0.88) 3,0 68,0 arc(70.12,0.88) 71,3 71,47 arc(70.12,49.12) 68,50 3,50 arc(0.88,49.12) 0,47
Stack: Top Layer 0.035mm / Dielectric1 1.51mm FR4 er 4.5 / Bottom Layer 0.035mm

## Design rules (mm)
template: 自定义配置
spacing copperThickness1oz (default): track to track 0.203, other pairs 0.203 to 0.203
spacing copperThickness2oz: track to track 0.203, other pairs 0.152 to 0.3
track width copperThickness1oz (default): min 0.254, default 0.254, max 0.762
track width VCC &amp; GND: min 0.254, default 0.508, max 0.762
track width motor: min 0.127, default 0.254, max 2.54
differential pair differentialPair (default): width min 0.127, default 0.254, max 2.54; gap min 0.152, default 0.152
via viaSize (default): diameter min 0.5, default 0.61, max 10; hole min 0.3, default 0.305, max 6.299
net GND uses VCC &amp; GND
net 3V3 uses VCC &amp; GND
net VIN uses VCC &amp; GND
net AOUT2 uses motor
net AOUT1 uses motor
net 5V uses VCC &amp; GND
net BOUT2 uses motor
net BOUT1 uses motor
net VBAT uses VCC &amp; GND
net VIN_SW uses VCC &amp; GND

## Placement (name value [footprint] x y rotation side)
C1  100nF  [C0603]  20.41 13.47 90 top
C2  22pF  [C0603]  13.21 14.19 180 top
C3  22pF  [C0603]  17.16 14.18 0 top
C4  100nF  [C0603]  16.89 26.29 0 bottom
C5  100nF  [C0603]  21.07 26.28 180 bottom
C6  100nF  [C0603]  16.89 23.73 0 bottom
C7  100nF  [C0603]  21.07 23.74 180 bottom
C8  1uF  [C0603]  33.2 28.69 270 top
C9  100nF  [C0603]  56.82 38.73 270 top
C10  220uF 25V  [CAP-SMD_BD6.3-L6.6-W6.6-LS7.2-FD]  42 33 180 top
C11  1uF  [C0603]  30.13 25.19 90 top
C12  100nF  [C0603]  26.63 28.69 270 top
C13  100nF  [C0603]  64.44 11.19 90 top
C14  100nF  [C0603]  55.42 22 0 top
C15  47uF  [C0603]  48.12 32.03 90 top
C16  22pF  [C0603]  40.11 15.68 90 top
C17  22pF  [C0603]  50.12 32.03 90 top
C18  47uF  [C0603]  42.35 15.68 90 top
C19  4.7uF  [C0603]  52.12 32.03 90 top
C20  10uF  [C0603]  48.5 19 0 top
C21  220uF 25V  [CAP-SMD_BD6.3-L6.6-W6.6-LS7.2-FD]  65 25 0 top
C22  100nF  [C0603]  54.12 32.03 270 top
D1  SMBJ3.3A  [SMB_L4.6-W3.6-LS5.3-RD]  29.59 21.14 0 top
D2  SS54  [SMA_L4.3-W2.6-LS5.0-FD]  42 27.5 0 top
F1  BSMD0603-050-6V  [F0603]  28.13 25.19 270 top
H1  PZ254V-11-04P  [HDR-TH_4P-P2.54-V-M]  6.5 31 270 top
H2  PZ254V-11-04P  [HDR-TH_4P-P2.54-V-M]  6.5 19 90 top
H3  PZ254V-11-04P  [HDR-TH_4P-P2.54-V-M]  35.7 19 90 top
H4  PZ254V-11-04P  [HDR-TH_4P-P2.54-V-M]  35.7 31 270 top
H5  PZ254V-11-04P  [HDR-TH_4P-P2.54-V-M]  2.5 25 90 top
H6  2.54-1*10P针  [HDR-TH_10P-P2.54-V-M-1]  19 5 0 top
H7  2.54-1*10P针  [HDR-TH_10P-P2.54-V-M-1]  19 45 0 top
H8  PZ2.54-2*4  [HDR-TH_8P-P2.54-V-M-R2-C4-S2.54]  38 3.73 180 top
H9  XY301V-A-5.0-2P  [CONN-TH_XY301V-A-5.0-2P]  38 46 0 top
H10  -  [XH2.54-LI-6P弯针]  62 45 270 top
H11  -  [XH2.54-LI-6P弯针]  59.26 5 90 top
KEY1  TS-1088-AR02016  [SW-SMD_L3.9-W3.0-P4.45]  23.41 13.46 90 top
L1  6.8uH  [IND-SMD_L7.0-W6.6]  42 22 0 top
LED1  NCD0805R1  [LED0805-R-RD]  10 27 270 top
LED2  NCD0805R1  [LED0805-R-RD]  10 22 90 top
P1  2.54-2*3P针  [HDR-TH_6P-P2.54-V-M-R2-C3-S2.54-1]  19 36 270 top
R1  10kΩ  [R0603]  26.41 13.46 90 top
R2  1MΩ  [R0603]  15.2 16.13 0 top
R3  10kΩ  [R0603]  15 36 270 top
R4  500Ω  [R0603]  10 31.5 270 top
R5  500Ω  [R0603]  10 17.5 90 top
R6  10kΩ  [R0603]  23 36 90 top
R7  10kΩ  [R0603]  55.42 28 180 top
R8  0Ω  [R0603]  55.42 26 180 top
R9  6.8kNTC  [R0603]  55.42 24 180 top
R10  10kΩ  [R0603]  44.36 16.67 90 top
R11  3.3kΩ  [R0603]  44.36 13.56 90 top
R12  250Ω  [R0603]  64.44 38.87 90 top
R13  250Ω  [R0603]  56.82 11.18 270 top
SW1  SS12D10G5  [SW-TH_SHOU-HAN_SS12D10G4]  48 43 270 top
U1  STM32F103C8T6  [LQFP-48_L7.0-W7.0-P0.50-LS9.0-BL]  19 25 0 top
U2  RT9013-33GB  [SOT-23-5_L3.0-W1.7-P0.95-LS2.8-BL]  29.4 28.69 90 top
U3  AT8236  [ESOP-8_L4.9-W3.9-P1.27-LS6.0-BL-EP]  60.6 34 180 top
U4  AT8236  [ESOP-8_L4.9-W3.9-P1.27-LS6.0-BL-EP]  60.6 16 0 top
U5  RT8289GSP  [SOIC-8_L5.0-W4.0-P1.27-LS6.0-BL-EP2.0]  50.12 25 0 top
X1  8MHz  [CRYSTAL-SMD_L5.0-W3.2]  15.23 11.14 0 top

## Footprints (pads in the part's own frame, mm; a bottom-side part is the same pattern mirrored in y, then rotated)
C0603
  rect 0.8x0.9 smd: 1(-0.7,0) 2(0.7,0)
CAP-SMD_BD6.3-L6.6-W6.6-LS7.2-FD
  rect 3.5x1.2 smd: 1(-2.67,0) 2(2.67,0)
CONN-TH_XY301V-A-5.0-2P
  round 2 hole 1.2: 1(-2.5,0) 2(2.5,0)
CRYSTAL-SMD_L5.0-W3.2
  rect 1.9x2.4 smd: 1(-2.05,0) 2(2.05,0)
ESOP-8_L4.9-W3.9-P1.27-LS6.0-BL-EP
  rect 0.6x1.2 smd: 1(-1.905,-2.909) 2(-0.635,-2.909) 3(0.635,-2.909) 4(1.905,-2.909) 5(1.905,2.909) 6(0.635,2.909) 7(-0.635,2.909) 8(-1.905,2.909)
  rect 3.3x2.4 smd: 9(0,0)
F0603
  rect 0.806x0.864 smd: 1(-0.753,0) 2(0.753,0)
HDR-TH_4P-P2.54-V-M
  rect 1.7x1.7 hole 1.1: 1(-3.81,0)
  round 1.7 hole 1.1: 2(-1.27,0) 3(1.27,0) 4(3.81,0)
HDR-TH_6P-P2.54-V-M-R2-C3-S2.54-1
  rect 1.8x1.8 hole 1.05: 1(-2.54,-1.27)
  round 1.8 hole 1.05: 2(-2.54,1.27) 3(0,-1.27) 4(0,1.27) 5(2.54,-1.27) 6(2.54,1.27)
HDR-TH_8P-P2.54-V-M-R2-C4-S2.54
  rect 1.7x1.7 hole 1.1: 1(-3.81,-1.27)
  round 1.7 hole 1.1: 2(-3.81,1.27) 3(-1.27,-1.27) 4(-1.27,1.27) 5(1.27,-1.27) 6(1.27,1.27) 7(3.81,-1.27) 8(3.81,1.27)
HDR-TH_10P-P2.54-V-M-1
  rect 1.575x1.7 hole 1.1: 1(-11.43,0)
  round 1.7 hole 1.1: 2(-8.89,0) 3(-6.35,0) 4(-3.81,0) 5(-1.27,0) 6(1.27,0) 7(3.81,0) 8(6.35,0) 9(8.89,0) 10(11.43,0)
IND-SMD_L7.0-W6.6
  rect 2.4x3.2 smd: 1(-3,0) 2(3,0)
LED0805-R-RD
  rect 1x1.399 smd: 1(1.05,0) 2(-1.05,0)
LQFP-48_L7.0-W7.0-P0.50-LS9.0-BL
  oval 0.27x1.5 smd: 1(-2.75,-4.25) 2(-2.25,-4.25) 3(-1.75,-4.25) 4(-1.25,-4.25) 5(-0.75,-4.25) 6(-0.25,-4.25) 7(0.25,-4.25) 8(0.75,-4.25) 9(1.25,-4.25) 10(1.75,-4.25) 11(2.25,-4.25) 12(2.75,-4.25) 25(2.75,4.25) 26(2.25,4.25) 27(1.75,4.25) 28(1.25,4.25) 29(0.75,4.25) 30(0.25,4.25) 31(-0.25,4.25) 32(-0.75,4.25) 33(-1.25,4.25) 34(-1.75,4.25) 35(-2.25,4.25) 36(-2.75,4.25)
  oval 1.5x0.27 smd: 13(4.25,-2.75) 14(4.25,-2.25) 15(4.25,-1.75) 16(4.25,-1.25) 17(4.25,-0.75) 18(4.25,-0.25) 19(4.25,0.25) 20(4.25,0.75) 21(4.25,1.25) 22(4.25,1.75) 23(4.25,2.25) 24(4.25,2.75) 37(-4.25,2.75) 38(-4.25,2.25) 39(-4.25,1.75) 40(-4.25,1.25) 41(-4.25,0.75) 42(-4.25,0.25) 43(-4.25,-0.25) 44(-4.25,-0.75) 45(-4.25,-1.25) 46(-4.25,-1.75) 47(-4.25,-2.25) 48(-4.25,-2.75)
R0603
  rect 0.806x0.864 smd: 1(-0.753,0) 2(0.753,0)
SMA_L4.3-W2.6-LS5.0-FD
  rect 2.046x1.62 smd: 1(-2.304,-0.009) 2(2.304,0.009)
SMB_L4.6-W3.6-LS5.3-RD
  rect 2.047x2.192 smd: 1(-2.361,0) 2(2.361,0)
SOIC-8_L5.0-W4.0-P1.27-LS6.0-BL-EP2.0
  oval 0.574x2.038 smd: 1(-1.905,-2.769) 2(-0.635,-2.769) 3(0.635,-2.769) 4(1.905,-2.769) 5(1.905,2.769) 6(0.635,2.769) 7(-0.635,2.769) 8(-1.905,2.769)
  rect 2x2 smd: 9(0,0)
SOT-23-5_L3.0-W1.7-P0.95-LS2.8-BL
  rect 0.49x1.157 smd: 1(-0.95,-1.153) 2(0,-1.153) 3(0.95,-1.153)
  rect 0.49x1.175 smd: 4(0.95,1.153) 5(-0.95,1.153)
SW-SMD_L3.9-W3.0-P4.45
  rect 1.23x1.36 smd: 1(-2.185,0) 2(2.185,0)
SW-TH_SHOU-HAN_SS12D10G4
  oval 1.7x2.9 hole 1.1x2.3: 1(-4.8,0) 2(0,0) 3(4.8,0)
XH2.54-LI-6P弯针
  rect 1.65x1.65 hole 1.1: 1(3.556,4.979)
  round 1.65 hole 1.1: 2(3.556,2.438) 3(3.556,-0.102) 4(3.556,-2.642) 5(3.556,-5.181) 6(3.556,-7.721)

## Nets
As in the schematic.

Pads without a net: SW1 1; U2 4; U5 2 3

## Via types
v1: diameter 0.61, hole 0.305, Top Layer to Bottom Layer, 251 vias

## Routing (per net, layer and track width the routed paths; a pad name or vN(x,y) marks a point on that pad's centre or on a via; arc(x,y) is an arc through that point)
3V3: length 155.6
  Top Layer w0.305: U1.24 20.26,27.75 v1(20.19,27.81) ; v1(16.26,27.69) 16.25,27.69 U1.36 16.26,29.26 v1(16.26,30.35) ; U1.9 20.25,22.03 v1(20.18,22.1) ; v1(13.59,21.84) 14,22.25 U1.48 17.75,22.25 v1(17.78,22.22)
  Top Layer w0.508: LED1.1 9.06,25.95 v1(9.02,25.91) ; H6.6 26.41,11.14 26.41,13.2 26.42,13.21 v1(31.37,13.21) 31.37,7.82 H8.7 H8.5 ; LED2.1 9.01,23.05 v1(8.99,23.03) ; v1(62.48,14.22) 62.5,14.2 U4.4 ; v1(56.51,36.07) 57.85,36.07 U3.4 ; P1.1 P1.2
  Bottom Layer w0.508: P1.2 21.63,37.18 21.63,32.9 19.64,30.91 16.81,30.91 v1(16.26,30.35) ; v1(16.26,27.69) 16.72,27.22 17.26,27.22 17.77,26.71 17.77,26.29 ; v1(25.02,21.21) 22.72,21.21 20.18,23.75 v1(20.18,22.1) ; v1(17.78,22.22) 17.78,23.72 17.77,23.73 ; v1(28.7,20.45) 28.7,15.88 v1(31.37,13.21) 31.75,12.83 61.09,12.83 v1(62.48,14.22) ; v1(20.19,27.81) 20.19,26.3 20.18,26.29 ; v1(9.02,25.91) 8.99,25.88 v1(8.99,23.03) 9.41,22.61 11.87,22.61 12.64,21.84 v1(13.59,21.84) ; v1(56.51,36.07) 52.83,36.07 41.4,24.64 30.1,24.64 28.7,23.24 v1(28.7,21.84)
  vias: v1(25.02,20.57) v1(25.4,21.72) v1(25.4,20.07) v1(25.78,21.21) v1(25.78,20.57) v1(28.7,21.14)
5V: length 159.1
  Top Layer w0.508: v1(52.07,7.37) 42.18,7.37 39.24,10.31 v1(39.24,10.54) 39.2,10.58 39.2,15.87 39.71,16.38 C16.2 ; C13.1 64.44,8.56 H11.5 ; H1.4 4.88,28.81 H5.4 ; C9.1 H10.5 ; H8.3 H8.1 ; v1(25.53,8.89) 26.92,8.89 v1(28.57,10.54)
  Bottom Layer w0.508: v1(52.07,7.37) 53.59,5.84 61.72,5.84 H11.5 ; v1(28.57,10.54) v1(39.24,10.54) 39.24,5.03 H8.3 ; H1.4 H2.4 4.19,20.5 4.19,13.33 8.64,8.89 v1(25.53,8.89) ; v1(42.4,19.43) 54.36,19.43 68.83,33.91 68.83,42.93 68.07,43.69 58.29,43.69 56.82,42.21 H10.5
  vias: v1(40.13,19.43) v1(40.13,18.44) v1(40.13,17.55) v1(41.2,19.43) v1(41.16,18.44) v1(41.21,17.55) v1(42.35,18.44) v1(42.35,17.55)
GND: length 27.8
  Top Layer w0.254: v1(21.98,27.09) 22.14,27.25 U1.23 ; v1(27.04,30.09) 27.04,29.79 C12.1 ; v1(33.15,30.61) 33.2,30.55 C8.1 ; U1.8 19.75,19.75 v1(20.96,18.54) ; v1(15.97,22.93) 15.79,22.75 U1.47
  Top Layer w0.305: 18.41,27.81 17.2,27.81 16.76,28.24 16.76,28.45 ; 16.76,28.44 16.76,28.45 ; 16.76,28.45 16.76,28.57
  Top Layer w0.381: v1(29.34,30.73) 29.34,29.21 29.86,28.69 U2.2 ; U5.6 50.75,25.64 U5.9
  Top Layer w0.508: v1(43.18,13.59) 43.97,12.8 R11.1 ; v1(18.03,13.21) 18.03,14.17 18.04,14.19 ; 23.41,11.28 v1(23.41,12.27) ; R13.2 H11.2 ; v1(12.32,13.21) 12.33,13.22 12.33,14.19 ; 20.41,12.56 v1(20.41,11.63)
  Top Layer w0.762: R12.2 H10.2
  Bottom Layer w0.508: v1(57.28,37.34) 59.06,35.56 v1(59.69,35.56)
  vias: v1(10.03,33.27) v1(12.57,8) v1(12.59,7.11) v1(13.66,8) v1(13.68,7.11) v1(14.35,20.95) v1(14.75,8) v1(14.77,7.11) v1(15.5,41.78) v1(15.84,8) v1(15.86,7.11) v1(16,25.15) v1(16.89,41.78) v1(18.16,41.78) v1(19.34,41.78) v1(20.19,16.13) v1(20.69,41.78) v1(21.72,25.15) v1(23.25,19.81) v1(30.48,22.1) v1(30.48,21.46) v1(30.48,20.83) v1(30.48,20.07) v1(31.88,34.67) v1(31.88,33.91) v1(32.64,34.67) v1(32.64,33.91) v1(33.4,34.67) v1(33.4,33.91) v1(33.4,21.72) v1(33.4,21) v1(33.4,20.29) v1(33.66,9.53) v1(33.72,8.25) v1(33.72,7.11) v1(34.86,9.53) v1(34.93,8.25) v1(34.93,7.11) v1(36.06,9.54) v1(36.13,8.27) v1(36.13,7.13) v1(37.27,9.54) v1(37.33,8.27) v1(37.33,7.13) v1(37.87,34.06) v1(37.94,32.06) v1(38.23,28.07) v1(38.23,27.23) v1(38.62,34.06) v1(38.69,32.06) v1(38.99,28.7) v1(39.33,34.06) v1(39.41,32.06) v1(39.84,28.7) v1(40.12,34.06) v1(40.1,14.04) v1(40.19,32.06) v1(40.57,28.7) v1(40.83,34.06) v1(40.91,32.06) v1(42.34,14.04) v1(42.62,9.27) v1(43.75,9.27) v1(44.96,9.27) v1(46.09,9.27) v1(46.48,17.02) v1(47.12,14.22) v1(47.3,9.27) v1(47.51,17.02) v1(48.26,14.22) v1(48.43,9.27) v1(48.55,17.02) v1(49.52,14.22) v1(49.64,9.27) v1(50.77,9.27) v1(50.93,14.22) v1(52.1,33.67) v1(53.09,34.35) v1(53.09,33.66) v1(54.12,33.67) v1(56.51,37.34) v1(59.18,14.48) v1(59.94,14.48) v1(60.45,35.56) v1(60.71,14.48) v1(61.22,35.56) v1(61.47,14.48) v1(61.99,35.56) v1(64.01,13.46) v1(64.04,12.79) v1(64.84,12.81) v1(66.17,26.03) v1(66.24,24.03) v1(66.92,26.03) v1(66.99,24.03) v1(67.63,26.03) v1(67.71,24.03) v1(68.42,26.03) v1(68.49,24.03) v1(69.13,26.03) v1(69.21,24.03)
VBAT: length 20.7
  Top Layer w0.305: U1.1 16.25,19.42 15.23,18.41 13.7,18.41 10.56,15.26 10.56,7.15 8.41,5 H6.1
VIN:
  vias: v1(48.01,29.97) v1(49,29.97) v1(49.53,29.21) v1(50,29.97) v1(51,29.97) v1(52,29.97) v1(53,29.97) v1(54,29.97) v1(55,29.97) v1(56.9,31.5) v1(56.9,30.73) v1(56.9,29.97) v1(57.78,31.5) v1(57.78,30.73) v1(57.78,29.97) v1(57.91,27.84) v1(57.91,27.11) v1(57.91,26.38) v1(57.91,25.65) v1(58.55,29.97) v1(58.67,27.78) v1(58.67,27.05) v1(58.67,26.32) v1(58.67,25.59) v1(62.61,20.57) v1(62.61,19.94) v1(63.25,23.88) v1(63.25,20.57) v1(63.25,19.94) v1(63.25,19.3) v1(63.25,18.67) v1(63.88,23.88) v1(63.88,19.94) v1(63.88,19.3) v1(64.52,25.15) v1(64.52,24.51) v1(64.52,23.88)
AOUT1: length 12
  Top Layer w2.032: H10.1 66.98,35.23 62.87,31.11
AOUT2: length 26.5
  Top Layer w0.508: v1(60.32,31.88) 60.18,31.73 59.71,31.73 v1(59.44,32)
  Top Layer w0.762: v1(59.82,30.1) 59.94,30.1 59.97,30.08 ; v1(60.07,29.46) 59.97,29.57 59.97,30.08 ; v1(60.83,29.34) 60.39,29.78 ; 60.39,29.78 v1(60.58,29.97) ; 60.39,29.78 60.26,29.78 59.97,30.08
  Top Layer w1.016: 59.97,30.08 U3.6 59.97,31.73
  Top Layer w2.032: 56.64,33.53 54.28,35.89 H10.6
  Bottom Layer w0.508: v1(59.44,32) 59.56,31.88 v1(60.32,31.88)
  Bottom Layer w0.762: v1(56.51,33.91) v1(57.15,33.91) 58.29,33.91 v1(59.94,32.26) v1(60.32,31.88) ; v1(55.88,33.78) 55.88,33.53 v1(56.26,33.15) v1(56.92,33.15) 58.29,33.15 v1(59.44,32)
  Bottom Layer w1.27: 59.94,31.88 59.94,29.72 60.2,29.46 60.32,29.46
BOOT0: length 17.8
  Top Layer w0.254: 15,35.2 15,34.29 ; v1(13.84,30.48) 13.84,29.08 v1(14.48,28.45) ; v1(11.43,23.5) 12.85,23.5 13.6,24.25 U1.44
  Bottom Layer w0.254: v1(11.43,23.5) 11.05,23.88 11.05,25.49 14,28.45 v1(14.48,28.45) ; v1(13.84,30.48) 14.99,31.62 v1(14.99,34.16)
BOOT1: length 12.3
  Top Layer w0.254: v1(22.99,34.16) 22.99,35.19 23,35.2 ; v1(24.89,25.91) 24.73,25.75 U1.20
  Bottom Layer w0.254: v1(24.89,25.91) 24,25.91 23.62,26.29 23.62,33.53 v1(22.99,34.16)
BOUT1: length 11.8
  Top Layer w2.032: H11.1 54.28,14.49 58.45,18.66
BOUT2: length 21.3
  Top Layer w1.016: v1(60.71,21.34) 60.71,20.83 ; 60.71,20.83 v1(60.71,20.32) ; 60.71,20.83 v1(60.32,20.83) ; 60.71,20.83 v1(61.09,20.83) 61.09,20.37 ; 61.21,18.03 61.24,18.06 61.24,20.12 v1(61.37,20.26)
  Top Layer w2.032: 64.01,16.64 v1(64.24,16.41) 66.98,13.67 H11.6
  Bottom Layer w1.016: 61.09,19.94 61.09,20.45 ; 60.77,20.26 60.77,21.27 v1(60.71,21.34)
  Bottom Layer w1.27: 64.39,16.38 v1(63.5,16.38) 62.74,16.38 61.21,17.91 61.09,19.94
  vias: v1(60.96,18.03) v1(61.47,18.03) v1(63.5,17.16)
FB: length 13.5
  Top Layer w0.254: R11.2 R10.1 48.43,15.91 52.02,19.51 U5.4
OSCIN: length 12.9
  Top Layer w0.254: X1.1 13.84,11.81 13.84,13.9 14.13,14.19 14.13,15.86 15.28,17.01 17.38,17.01 18.25,17.88 U1.5
OSCOUT: length 12
  Top Layer w0.254: U1.6 18.75,17.73 17.14,16.13 16,16.13 16,14.43 16.51,13.92 16.51,11.91 X1.2
P_EN: length 6
  Top Layer w0.381: R7.1 R8.1 R9.1 56.17,22.05 C14.2
P_EN1: length 4.1
  Top Layer w0.381: 54.66,26 52.49,26 52.02,26.46 U5.5
PA0: length 47
  Top Layer w0.254: U1.10 20.75,19.75 22.87,17.63 30.45,17.63 41.9,6.18 58.38,6.18 59.31,7.11 59.31,8.51 H11.3
PA1: length 47.8
  Top Layer w0.254: U1.11 21.25,19.9 23.06,18.08 30.64,18.08 42.09,6.64 57.82,6.64 v1(58.17,6.98)
  Bottom Layer w0.254: H11.4 60.33,6.98 v1(58.17,6.98)
PA2: length 15.4
  Top Layer w0.254: U1.12 21.75,20.04 23.25,18.54 34.69,18.54 35.5,17.73
PA3: length 15.2
  Top Layer w0.254: U1.13 23.85,22.25 24,22.1 24,20.32 25.32,19 34.23,19 35.5,20.27
PA4: length 22
  Top Layer w0.254: v1(24.51,22.48) 24.24,22.75 U1.14
  Bottom Layer w0.254: v1(24.51,22.48) 25.99,22.48 26.44,22.03 26.44,8.63 H6.7
PA5: length 21.9
  Top Layer w0.254: v1(25.02,23.11) 24.88,23.25 U1.15
  Bottom Layer w0.254: H6.8 25.35,6.55 26.9,8.1 26.9,22.22 26,23.11 v1(25.02,23.11)
PA6: length 47.6
  Top Layer w0.254: U1.16 26.04,23.75 v1(26.8,24.51) ; v1(52.2,39.5) v1(52.2,37.72)
  Bottom Layer w0.254: H10.3 59.95,39.5 v1(52.2,39.5) ; v1(52.2,37.72) 52.2,36.69 41.06,25.55 27.84,25.55 v1(26.8,24.51)
PA7: length 45.2
  Top Layer w0.254: v1(26.8,25.53) 25.52,24.25 U1.17 ; v1(51.31,39.5) v1(51.31,37.72)
  Bottom Layer w0.254: v1(51.31,39.5) 51.31,39.88 51.56,40.13 58.05,40.13 H10.4 ; v1(26.8,25.53) 27.28,26.01 40.87,26.01 51.31,36.45 v1(51.31,37.72)
PA8: length 21.6
  Top Layer w0.254: U1.29 19.75,30.85 21.7,32.79 24.02,32.79 24.8,33.58 24.8,41.34 21.14,45 H7.6
PA9: length 27.2
  Top Layer w0.254: v1(19.3,32.13) 19.25,32.08 U1.30
  Bottom Layer w0.254: H2.2 6.81,17.73 8.35,19.27 8.35,28.67 8.76,29.08 13.99,29.08 16.4,31.5 18.67,31.5 v1(19.3,32.13)
PA10: length 24
  Top Layer w0.254: U1.31 18.75,31.67 v1(18.29,32.13)
  Bottom Layer w0.254: v1(18.29,32.13) 16.39,32.13 13.8,29.54 8.57,29.54 7.89,28.86 7.89,21.66 H2.3
PA11: length 20.4
  Top Layer w0.254: H7.4 13.36,43.17 13.36,32.75 14.08,32.03 17.27,32.03 18.25,31.05 U1.32
PA12: length 19.7
  Top Layer w0.254: U1.33 17.75,30.9 17.08,31.57 13.89,31.57 12.9,32.56 12.9,44.75 H7.3
PA13: length 13.2
  Top Layer w0.254: v1(12.95,31.11) 16.89,31.11 17.25,30.76 U1.34 ; H1.3 6.74,29.73 v1(8.38,31.37)
  Bottom Layer w0.254: v1(8.38,31.37) 12.7,31.37 v1(12.95,31.11)
PA14: length 11.2
  Top Layer w0.254: v1(12.95,30.23) 12.95,28.33 13.54,27.75 U1.37
  Bottom Layer w0.254: H1.2 8.16,30.61 12.57,30.61 v1(12.95,30.23)
PA15: length 20.5
  Top Layer w0.254: U1.38 13.39,27.25 12.32,28.32 12.32,42.79 H7.2
PB0: length 26.9
  Top Layer w0.254: U1.18 25.28,24.75 26.11,25.58 26.11,25.98 v1(26.29,26.16)
  Bottom Layer w0.254: v1(26.29,26.16) 26.03,25.91 26.03,24.37 27.81,22.6 27.81,7.62 H6.10
PB1: length 25.9
  Top Layer w0.254: U1.19 25.13,25.25 25.53,25.64 v1(25.53,26.54)
  Bottom Layer w0.254: H6.9 27.89,6.78 27.36,7.32 27.36,22.41 25.53,24.24 v1(25.53,26.54)
PB3: length 22.1
  Top Layer w0.254: H7.1 11.86,40.71 11.86,28.13 13.24,26.75 U1.39
PB4: length 13.5
  Top Layer w0.254: H5.3 2.5,25.95 3.43,25.02 11.05,25.02 12.28,26.25 U1.40
PB5: length 13.1
  Top Layer w0.254: H5.2 3.28,24.51 11.19,24.51 12.43,25.75 U1.41
PB6: length 61.7
  Top Layer w0.254: v1(61.21,37.97) 61.21,36.93 61.24,36.91 ; v1(22.61,29.97) 24.31,29.97 v1(24.38,30.04) ; v1(12.06,24.26) 12.06,24.74 12.57,25.25 U1.42
  Bottom Layer w0.254: v1(61.21,37.97) 60.32,38.86 50.38,38.86 49.02,40.22 35.1,40.22 24.93,30.04 v1(24.38,30.04) ; v1(22.61,29.97) 16.9,29.97 12.06,25.14 v1(12.06,24.26)
PB7: length 57.5
  Top Layer w0.254: U3.3 59.94,36.93 v1(59.94,37.97) ; v1(12.95,24.51) 13.16,24.72 14.72,24.72 U1.43 ; v1(22.99,29.21) v1(24.38,29.21)
  Bottom Layer w0.254: v1(12.95,24.51) 12.95,25.38 16.78,29.21 v1(22.99,29.21) ; v1(24.38,29.21) 24.74,29.21 35.29,39.76 48.84,39.76 50.19,38.4 59.51,38.4 v1(59.94,37.97)
PB8: length 58.7
  Top Layer w0.254: U4.2 v1(59.97,12.06) ; v1(11.56,21.84) 11.92,21.84 13.83,23.75 U1.45 ; v1(29.34,14.1) 29.34,14.85 27.04,17.14 v1(22.22,17.14)
  Bottom Layer w0.254: v1(59.97,12.06) 30.11,12.06 29.34,12.84 v1(29.34,14.1) ; v1(22.22,17.14) 21.09,17.14 18.35,19.89 13.39,19.89 11.56,21.73 v1(11.56,21.84)
PB9: length 60.2
  Top Layer w0.254: v1(28.45,14.1) 28.45,15.09 27.16,16.38 v1(24.64,16.38) ; U1.46 13.98,23.25 11.56,20.83 ; v1(61.21,12.06) 61.24,12.09 61.24,13.09
  Bottom Layer w0.254: v1(28.45,14.1) 28.45,13.08 30.1,11.43 60.58,11.43 v1(61.21,12.06) ; v1(11.56,20.83) 12.95,19.43 18.16,19.43 21.21,16.38 v1(24.64,16.38)
PB10: length 17.1
  Top Layer w0.254: U1.21 24.34,26.25 25.22,27.13 25.22,30.76 26.72,32.26 35.01,32.26 35.5,31.77
PB11: length 13.5
  Top Layer w0.254: U1.22 24.13,26.75 24.51,27.13 v1(24.51,27.43)
  Bottom Layer w0.254: 35.5,29.23 34.46,28.19 25.27,28.19 v1(24.51,27.43)
PB12: length 20.7
  Top Layer w0.254: H7.10 26.63,41.2 26.63,32.82 24.77,30.96 22.45,30.96 21.75,30.26 U1.25
PB13: length 19.9
  Top Layer w0.254: U1.26 21.25,30.41 22.26,31.42 24.59,31.42 26.18,33.01 26.18,41.39 27.89,43.11 H7.9
PB14: length 19.3
  Top Layer w0.254: H7.8 25.72,44.63 25.72,33.2 24.4,31.88 22.07,31.88 20.75,30.55 U1.27
PB15: length 20.2
  Top Layer w0.254: U1.28 20.25,30.7 21.89,32.33 24.21,32.33 25.26,33.39 25.26,41.53 22.81,43.98 H7.7
PC13: length 9.5
  Top Layer w0.254: v1(16.51,18.67) 16.75,18.91 U1.2 ; v1(12.7,18.67) 10.73,16.7 10,16.7
  Bottom Layer w0.254: v1(12.7,18.67) v1(16.51,18.67)
PC14: length 20.5
  Top Layer w0.254: U1.3 17.25,18.17 17,17.92 13.9,17.92 11.04,15.06 11.04,6.95 10.11,6.02 H6.2
PC15: length 20.6
  Top Layer w0.254: H6.3 12.65,5.77 11.5,6.92 11.5,14.87 14.09,17.47 17.19,17.47 17.75,18.03 U1.4
RESET: length 26
  Top Layer w0.254: 20.41,14.36 19.56,14.36 19.18,13.98 19.18,8.99 H6.4 ; 20.41,14.36 22.12,14.36 KEY1.2 25.02,15.64 26.41,14.26 ; 20.41,14.36 19.25,15.52 U1.7
$1N6534: length 3.6
  Top Layer w0.508: U5.1 48.21,21.08 49.2,20.1 C20.2
$1N6590: length 8.4
  Top Layer w0.254: 61.24,31.09 61.21,31.11 v1(61.21,32.13)
  Top Layer w0.508: R12.1 v1(64.44,37.08)
  Bottom Layer w0.508: v1(64.44,37.08) 64.44,35.86 61.21,32.64 v1(61.21,32.13)
$1N26418: length 8.3
  Top Layer w0.508: v1(59.94,17.91) 59.94,18.89 U4.7 ; R13.1 56.82,13.64 v1(57.15,13.97)
  Bottom Layer w0.508: v1(57.15,13.97) 59.94,16.76 v1(59.94,17.91)
$1N86703: length 2.6
  Top Layer w0.254: LED1.2 10,30.7
$1N86706: length 2.6
  Top Layer w0.254: LED2.2 10,18.3
$1N86975: length 3.1
  Top Layer w0.254: 23,36.8 21.07,36.8 P1.4
$1N86977: length 3.1
  Top Layer w0.254: P1.3 16.93,36.8 15,36.8

## Copper pours and planes (outline as drawn; the poured copper is in the pictures)
3V3 on Top Layer: 27.69,24.89 28.83,24.89 29.08,24.64 29.08,19.97 28.83,19.72 25.32,19.72 24.76,20.27 24.76,21.6 27.69,24.2
3V3 on Bottom Layer: 17.02,27.18 20.91,27.18 20.91,22.77 17.02,22.77
3V3 on Bottom Layer: 24.64,22.1 26.03,22.1 26.03,19.81 24.64,19.81
3V3 on Bottom Layer: 28.32,22.42 28.32,19.99 29.08,19.99 29.08,22.42
5V on Top Layer: 29.97,30.1 31.88,30.1 32.27,29.71 32.27,28.69 33.46,28.69 34.09,28.07 35.83,28.07 40.91,23.42 42.19,21.05 45.21,18.03 45.21,16.89 43.85,16.89 42.71,15.75 39.2,15.75 39.2,18.77 36.38,21.59 34.54,21.59 33.78,22.35 33.78,25.65 32.05,27.39 29.98,27.39 29.98,28.03 30.15,28.19 31.4,28.19 31.4,29.06 31.37,29.08 30.1,29.08 29.97,29.21
5V on Bottom Layer: 39.5,20.19 43.06,20.19 43.06,16.76 39.5,16.76
GND on Top Layer: -0.64,49.24 70.37,49.24 70.37,-0.76 -0.64,-0.76
GND on Bottom Layer: 0.25,50 71.25,50 71.25,0 0.25,0
VIN on Top Layer: 43.11,39.76 50.46,39.76 50.46,36.75 46.61,32.59 46.61,31.88 58.38,31.82 60.07,27.56 65.15,26.13 65.15,19.81 63.63,18.29 61.92,18.29 61.92,21.41 57.4,22.32 57.4,28.7 55.37,28.7 55.37,27.47 54.86,26.96 52.83,26.96 52.83,29.34 50.16,29.34 50.16,26.54 48.9,26.54 48.9,29.08 48.64,29.34 44.37,29.34 42,31.7 42,38.65
VIN on Bottom Layer: 48.82,26.52 50.12,26.52 50.12,28.81 50.39,29.08 53.21,29.08 53.47,28.83 53.47,26.1 54.02,25.15 59.11,25.15 59.11,32.13 50.09,32.13 48.77,30.81 48.77,27.43 48.82,27.38
VIN on Bottom Layer: 61.92,18.29 63.63,18.29 65.15,19.81 65.15,26.13 63.35,26.64 60.71,23.69 60.71,22.03 61.92,21.66
VIN_SW on Top Layer: 38.35,47.24 38.35,41.28 50.93,41.28 50.93,47.21 50.93,47.24
$1N6587 on Top Layer: 42.8,28.83 48.53,28.83 48.64,28.7 48.64,25.78 47.12,24.26 47.12,21.09 48.37,19.84 48.37,18.16 46.1,18.16 42.8,21.46
$1N71314 on Top Layer: 26,28.44 29.19,28.44 29.43,28.19 29.43,27.27 30.13,26.58 30.53,26.58 30.71,26.39 30.71,25.43 27.64,25.43 27.37,26.74 26.92,27.18 26.29,27.18 26,27.47

Small or netless copper shapes (teardrops, artwork), in the pictures only: 193 on Top Layer, 63 on Bottom Layer
